# EAGLE schematic logic (EAGLE 9.6.2)
Assembly variants: basic

## Sheet 1 of 3: MCU
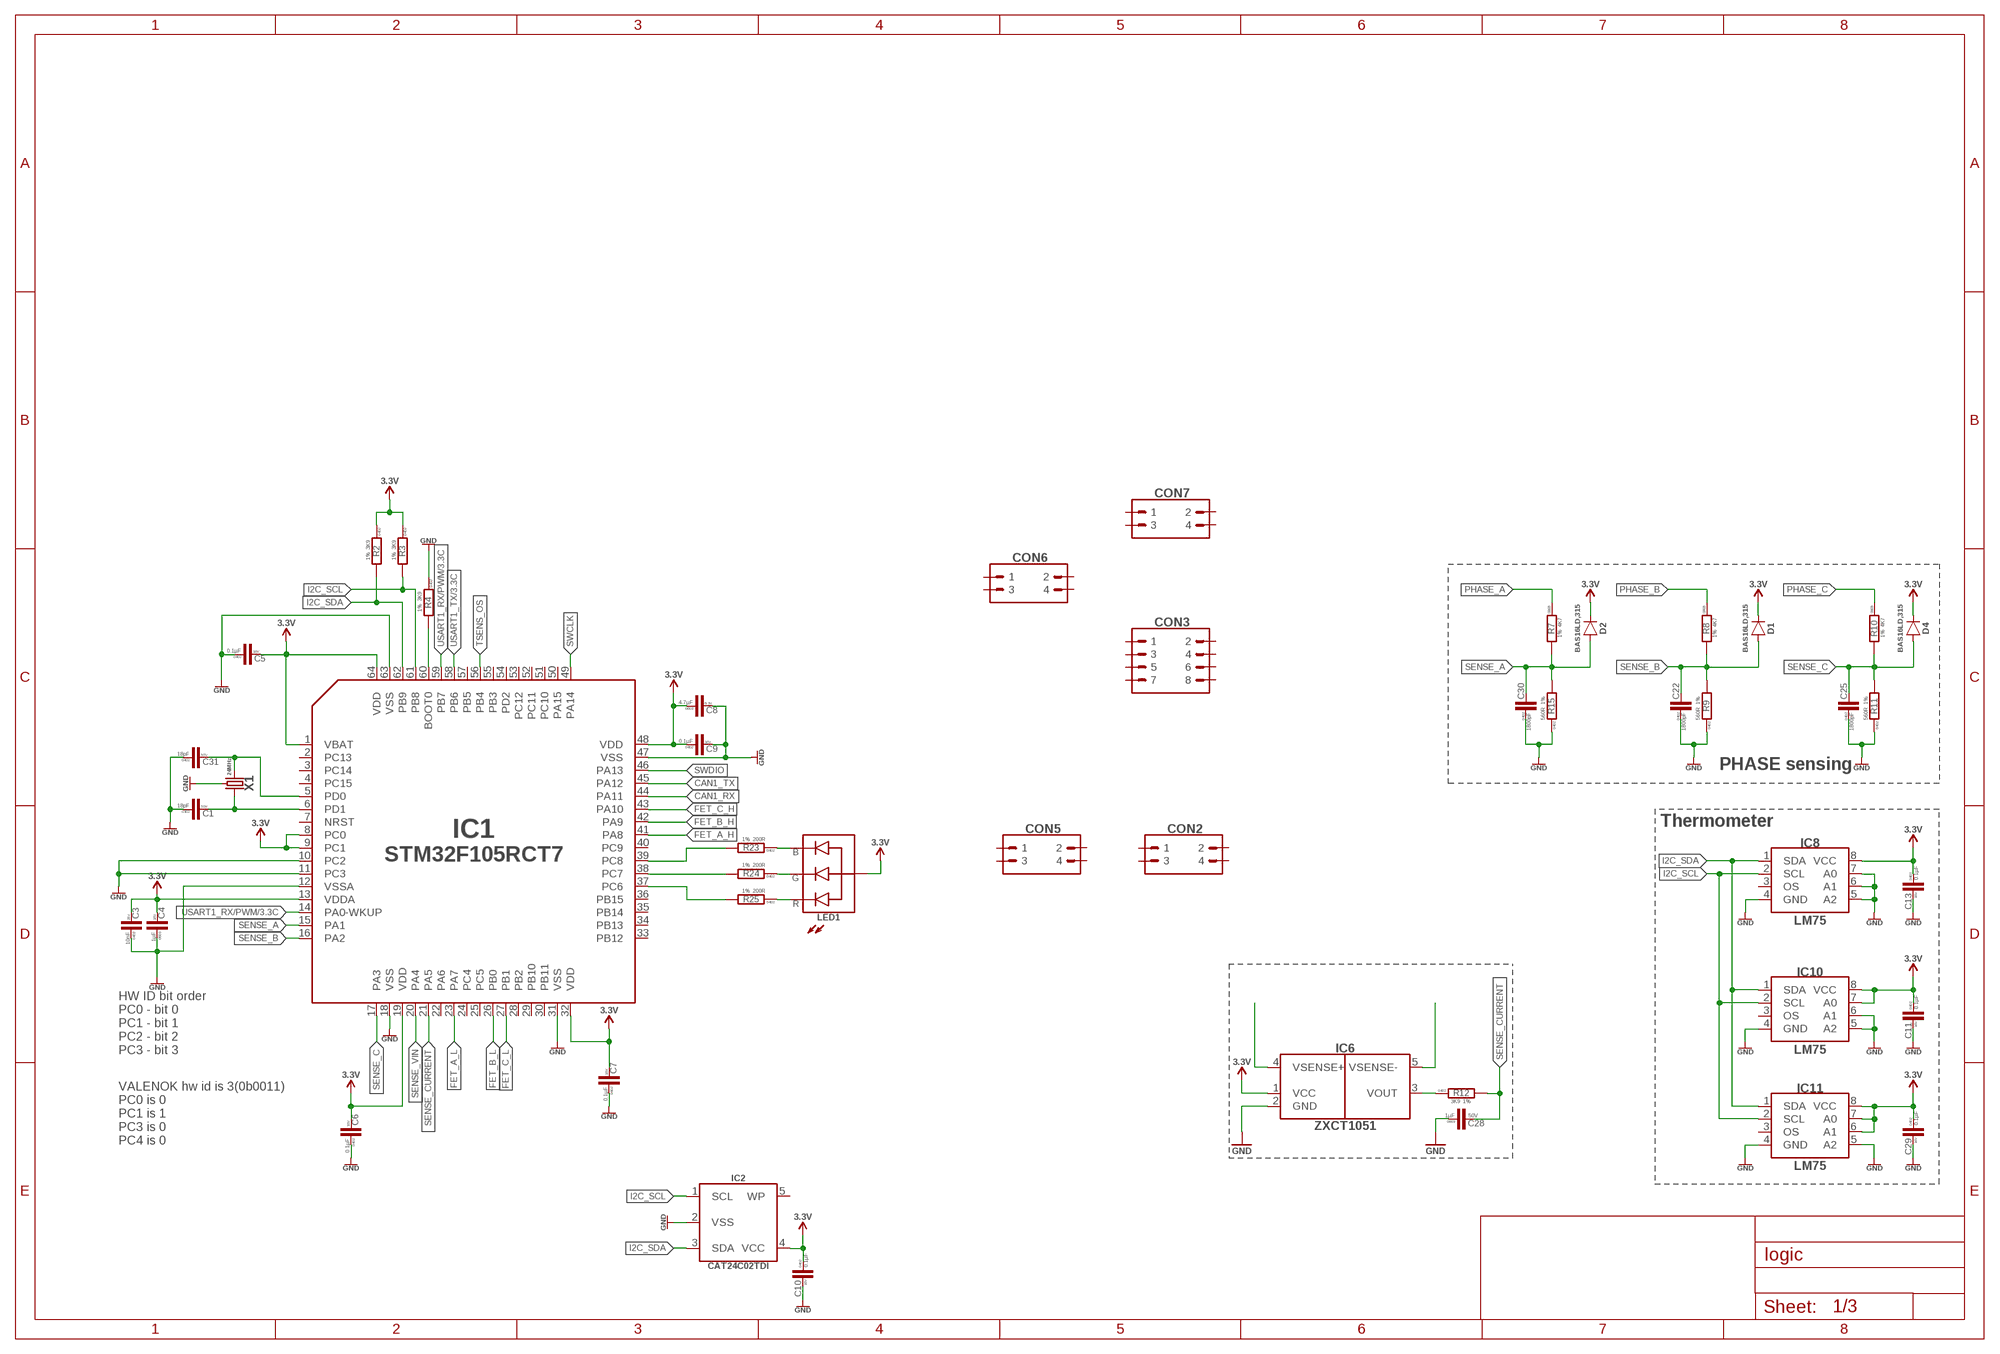
[diagram p0: schematic, sheet 1]

### Parts
C1  18pF  C-0402  [C0402]
C3  10nF  C-0402  [C0402]
C4  1µF  C-0603  [C0603]
C5  0.1µF  C-0402  [C0402]
C6  0.1µF  C-0402  [C0402]
C7  0.1µF  C-0402  [C0402]
C8  4.7µF  C-0603  [C0603]
C9  0.1µF  C-0402  [C0402]
C10  0.1µF  C-0402  [C0402]
C11  0.1µF  C-0402  [C0402]
C13  0.1µF  C-0402  [C0402]
C22  1800pF  C-0402  [C0402]
C25  1800pF  C-0402  [C0402]
C28  1µF  1µF-50V_10%_X7R-0603  [C0603]
C29  0.1µF  C-0402  [C0402]
C30  1800pF  C-0402  [C0402]
C31  18pF  C-0402  [C0402]
CON2  PINHEAD_2X02-PTH-2-MALE  [2X02-PTH-2]  (not fitted in variant basic)
CON3  PINHEAD_2X04-PLS-2  [2X04-PTH-2]
CON5  PINHEAD_2X02-PTH-2-MALE  [2X02-PTH-2]  (not fitted in variant basic)
CON6  PINHEAD_2X02-PTH-2-MALE  [2X02-PTH-2]  (not fitted in variant basic)
CON7  PINHEAD_2X02-PTH-2-MALE  [2X02-PTH-2]  (not fitted in variant basic)
D1  BAS16L  [SOD882]
D2  BAS16L  [SOD882]
D4  BAS16L  [SOD882]
IC1  STM32F105RCT6  [TQFP64]
IC2  CAT24C02  [SOT23-5L@1]
IC6  ZXCT1051  [SOT23-5L]
IC8  LM75-TSSOP8  [TSSOP8]
IC10  LM75-TSSOP8  [TSSOP8]
IC11  LM75-TSSOP8  [TSSOP8]
LED1  LTST-C19HE1WT  [0606]
R2  3K9  R-1%-0402  [R0402]
R3  3K9  R-1%-0402  [R0402]
R4  3K9  R-1%-0402  [R0402]
R7  4K7  R-1%-0805  [R0805]
R8  4K7  R-1%-0805  [R0805]
R9  560R  R-1%-0402  [R0402]
R10  4K7  R-1%-0805  [R0805]
R11  560R  R-1%-0402  [R0402]
R12  3K9  3K9-1%-0402  [R0402]
R15  560R  R-1%-0402  [R0402]
R23  200R  R-1%-0402  [R0402]
R24  200R  R-1%-0402  [R0402]
R25  200R  R-1%-0402  [R0402]
X1  24MHz  CRYSTAL-4P-24MHZ-3.2X2.5-4P  [OSCILLATOR-3.2X2.5-4P]

### Nets
BLABLA: IC6.3(VOUT) R12.1
BOOT0: IC1.60(BOOT0) R4.2
CAN1_RX: IC1.44(PA11)
CAN1_TX: IC1.45(PA12)
FET_A_H: IC1.41(PA8)
FET_A_L: IC1.23(PA7)
FET_B_H: IC1.42(PA9)
FET_B_L: IC1.26(PB0)
FET_C_H: IC1.43(PA10)
FET_C_L: IC1.27(PB1)
GND: C1.1 C3.1 C4.1 C5.1 C6.1 C7.1 C8.2 C9.2 C10.2 C11.2 C13.2 C22.1 C25.1 C28.P$1 C29.2 C30.1 C31.1 IC1.10(PC2) IC1.11(PC3) IC1.12(VSSA) IC1.18(VSS) IC1.31(VSS) IC1.47(VSS) IC1.63(VSS) IC2.2(VSS) IC6.2(GND) IC8.4(GND) IC8.5(A2) IC8.6(A1) IC8.7(A0) IC10.4(GND) IC10.5(A2) IC10.6(A1) IC11.4(GND) IC11.5(A2) R4.1 R9.1 R11.1 R15.1 X1.2(GND) X1.4(GND) ; also sheet 2,3
I2C_SCL: IC1.61(PB8) IC2.1(SCL) IC8.2(SCL) IC10.2(SCL) IC11.2(SCL) R3.2
I2C_SDA: IC1.62(PB9) IC2.3(SDA) IC8.1(SDA) IC10.1(SDA) IC11.1(SDA) R2.2
N$1: IC6.5(VSENSE-)
N$2: IC6.4(VSENSE+)
N$3: IC1.37(PC6) R25.2
N$6: LED1.B R23.1
N$7: LED1.R R25.1
N$12: IC1.38(PC7) R24.2
N$16: C31.2 IC1.5(PD0) X1.3
N$18: IC1.39(PC8) R23.2
N$21: C1.2 IC1.6(PD1) X1.1
N$26: LED1.G R24.1
PHASE_A: R7.1
PHASE_B: R8.1
PHASE_C: R10.1
SENSE_A: C30.2 D2.A IC1.15(PA1) R7.2 R15.2
SENSE_B: C22.2 D1.A IC1.16(PA2) R8.2 R9.2
SENSE_C: C25.2 D4.A IC1.17(PA3) R10.2 R11.2
SENSE_CURRENT: C28.P$2 IC1.21(PA5) R12.2
SENSE_VIN: IC1.20(PA4)
SWCLK: IC1.49(PA14)
SWDIO: IC1.46(PA13)
TSENS_OS: IC1.56(PB4)
USART1_RX/PWM: IC1.14(PA0-WKUP) IC1.59(PB7) ; also sheet 3
USART1_TX: IC1.58(PB6) ; also sheet 3
VDD_3V3: C3.2 C4.2 C5.2 C6.2 C7.2 C8.1 C9.1 C10.1 C11.1 C13.1 C29.1 D1.C D2.C D4.C IC1.1(VBAT) IC1.8(PC0) IC1.9(PC1) IC1.13(VDDA) IC1.19(VDD) IC1.32(VDD) IC1.48(VDD) IC1.64(VDD) IC2.4(VCC) IC6.1(VCC) IC8.8(VCC) IC10.7(A0) IC10.8(VCC) IC11.6(A1) IC11.7(A0) IC11.8(VCC) LED1.+(A) R2.1 R3.1 ; supply symbol labelled 3.3V ; also sheet 2,3
Unconnected: CON2.1 CON2.2 CON2.3 CON2.4 CON3.1 CON3.2 CON3.3 CON3.4 CON3.5 CON3.6 CON3.7 CON3.8 CON5.1 CON5.2 CON5.3 CON5.4 CON6.1 CON6.2 CON6.3 CON6.4 CON7.1 CON7.2 CON7.3 CON7.4 IC1.2(PC13) IC1.3(PC14) IC1.4(PC15) IC1.7(NRST) IC1.22(PA6) IC1.24(PC4) IC1.25(PC5) IC1.28(PB2) IC1.29(PB10) IC1.30(PB11) IC1.33(PB12) IC1.34(PB13) IC1.35(PB14) IC1.36(PB15) IC1.40(PC9) IC1.50(PA15) IC1.51(PC10) IC1.52(PC11) IC1.53(PC12) IC1.54(PD2) IC1.55(PB3) IC1.57(PB5) IC2.5(WP) IC8.3(OS) IC10.3(OS) IC11.3(OS)

### Notes on the sheet
- PHASE sensing
- Thermometer
- HW ID bit order
  PC0 - bit 0
  PC1 - bit 1
  PC2 - bit 2
  PC3 - bit 3
- VALENOK hw id is 3(0b0011)
  PC0 is 0
  PC1 is 1
  PC3 is 0
  PC4 is 0

## Sheet 2 of 3: Power
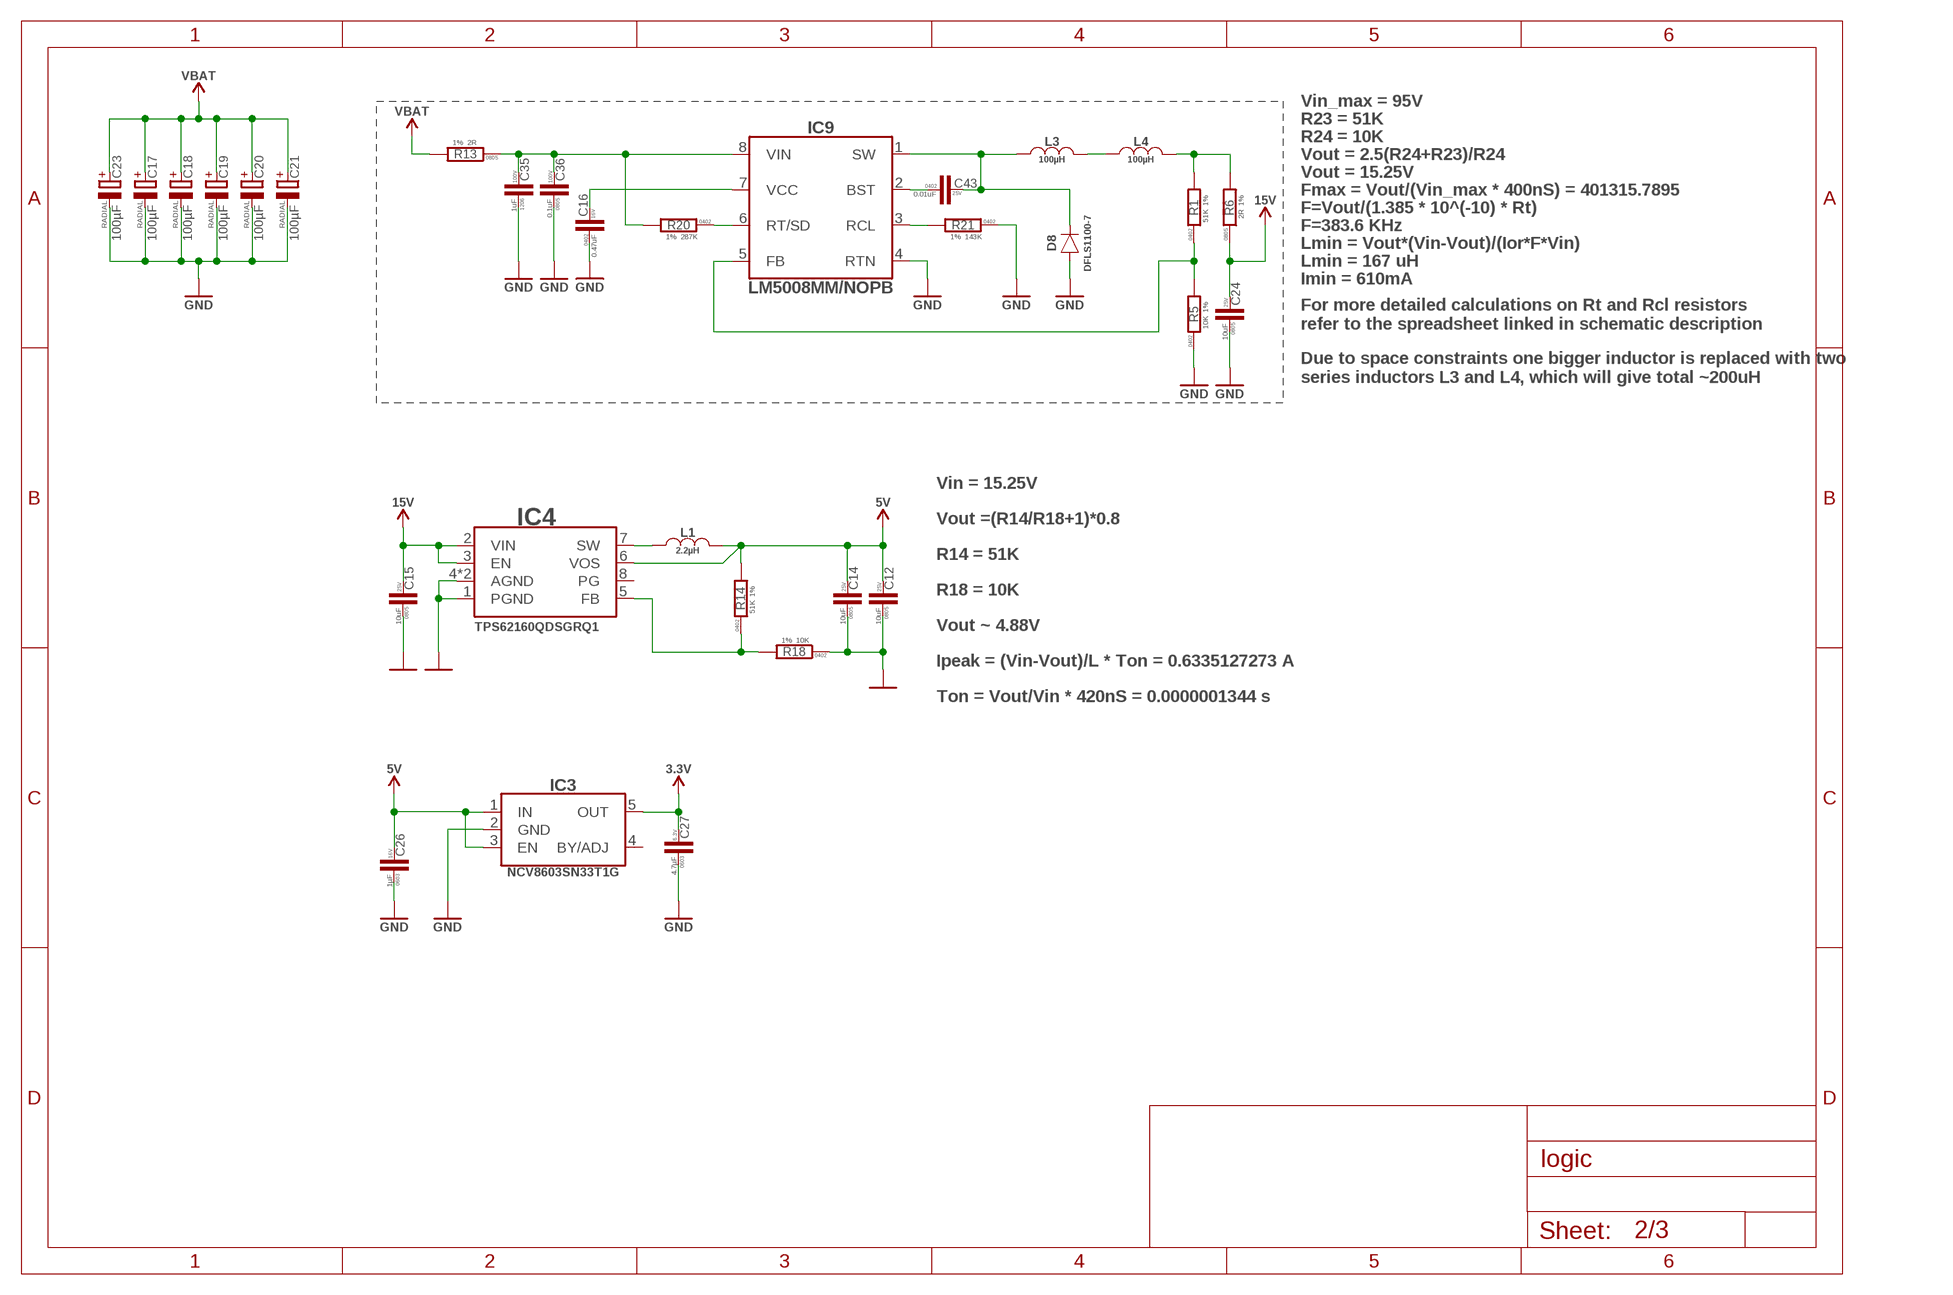
[diagram p1: schematic, sheet 2]

### Parts
C12  10uF  C-0805  [C0805]
C14  10uF  C-0805  [C0805]
C15  10uF  C-0805  [C0805]
C16  0.47uF  C-0402  [C0402]
C17  100µF  CPOL-RADIAL_SIDE-12.5-22  [RADIAL_SIDE_12.5X22]
C18  100µF  CPOL-RADIAL_SIDE-12.5-22  [RADIAL_SIDE_12.5X22]
C19  100µF  CPOL-RADIAL_SIDE-12.5-22  [RADIAL_SIDE_12.5X22]
C20  100µF  CPOL-RADIAL_SIDE-12.5-22  [RADIAL_SIDE_12.5X22]
C21  100µF  CPOL-RADIAL_SIDE-12.5-22  [RADIAL_SIDE_12.5X22]
C23  100µF  CPOL-RADIAL_SIDE-12.5-22  [RADIAL_SIDE_12.5X22]
C24  10uF  C-0805  [C0805]
C26  1µF  C-0603  [C0603]
C27  4.7µF  C-0603  [C0603]
C35  1uF  C-1206  [C1206]
C36  0.1uF  C-0805  [C0805]
C43  0.01uF  C-0402  [C0402]
D8  DFLS1100  [POWERDI-123]
IC3  NCV8603SN33  [SOT23-5]
IC4  TPS62160QDSGRQ1  [WFDFN-8]
IC9  LM5008-MSOP8  [MSOP8]
L1  2.2µH  2.2µH-NRS3015  [NR3015]
L3  100µH  100µH-LQS-6028  [LQS-6028]
L4  100µH  100µH-LQS-6028  [LQS-6028]
R1  51K  R-1%-0402  [R0402]
R5  10K  R-1%-0402  [R0402]
R6  2R  R-1%-0805  [R0805]
R13  2R  R-1%-0805  [R0805]
R14  51K  R-1%-0402  [R0402]
R18  10K  R-1%-0402  [R0402]
R20  287K  R-1%-0402  [R0402]
R21  143K  R-1%-0402  [R0402]

### Nets
GND: C12.1 C14.1 C15.1 C16.1 C17.- C18.- C19.- C20.- C21.- C23.- C24.1 C26.1 C27.1 C35.P$1 C36.1 D8.A IC3.2(GND) IC4.1(PGND) IC4.4(AGND) IC4.EP(AGND) IC9.4(RTN) R5.1 R18.1 R21.1 ; also sheet 1,3
N$4: IC4.7(SW) L1.1
N$5: C16.2 IC9.7(VCC)
N$8: IC9.6(RT/SD) R20.1
N$9: IC4.5(FB) R14.1 R18.2
N$10: C35.P$2 C36.2 IC9.8(VIN) R13.1 R20.2
N$11: C43.1 IC9.2(BST)
N$13: IC9.3(RCL) R21.2
N$14: C43.2 D8.C IC9.1(SW) L3.P$1
N$15: L4.P$2 R1.2 R6.2
N$17: L3.P$2 L4.P$1
N$50: IC9.5(FB) R1.1 R5.2
VBAT: C17.+ C18.+ C19.+ C20.+ C21.+ C23.+ R13.2
VDD_3V3: C27.2 IC3.5(OUT) ; supply symbol labelled 3.3V ; also sheet 1,3
VDD_5V: C12.2 C14.2 C26.2 IC3.1(IN) IC3.3(EN) IC4.6(VOS) L1.2 R14.2 ; supply symbol labelled 5V
VDD_15V: C15.2 C24.2 IC4.2(VIN) IC4.3(EN) R6.1 ; supply symbol labelled 15V
Unconnected: IC3.4(BY/ADJ) IC4.8(PG)

### Notes on the sheet
- Vin_max = 95V
- R23 = 51K
- R24 = 10K
- Vout = 2.5(R24+R23)/R24
- Vout = 15.25V
- Fmax = Vout/(Vin_max * 400nS) = 401315.7895
- F=Vout/(1.385 * 10^(-10) * Rt)
- F=383.6 KHz
- Lmin = Vout*(Vin-Vout)/(Ior*F*Vin)
- Lmin = 167 uH
- Imin = 610mA
- For more detailed calculations on Rt and Rcl resistors
  refer to the spreadsheet linked in schematic description
- Due to space constraints one bigger inductor is replaced with two
  series inductors L3 and L4, which will give total ~200uH
- Vin = 15.25V
- Vout =(R14/R18+1)*0.8
- R14 = 51K
- R18 = 10K
- Vout ~ 4.88V
- Ipeak = (Vin-Vout)/L * Ton = 0.6335127273 A
- Ton = Vout/Vin * 420nS = 0.0000001344 s

## Sheet 3 of 3: Interfaces
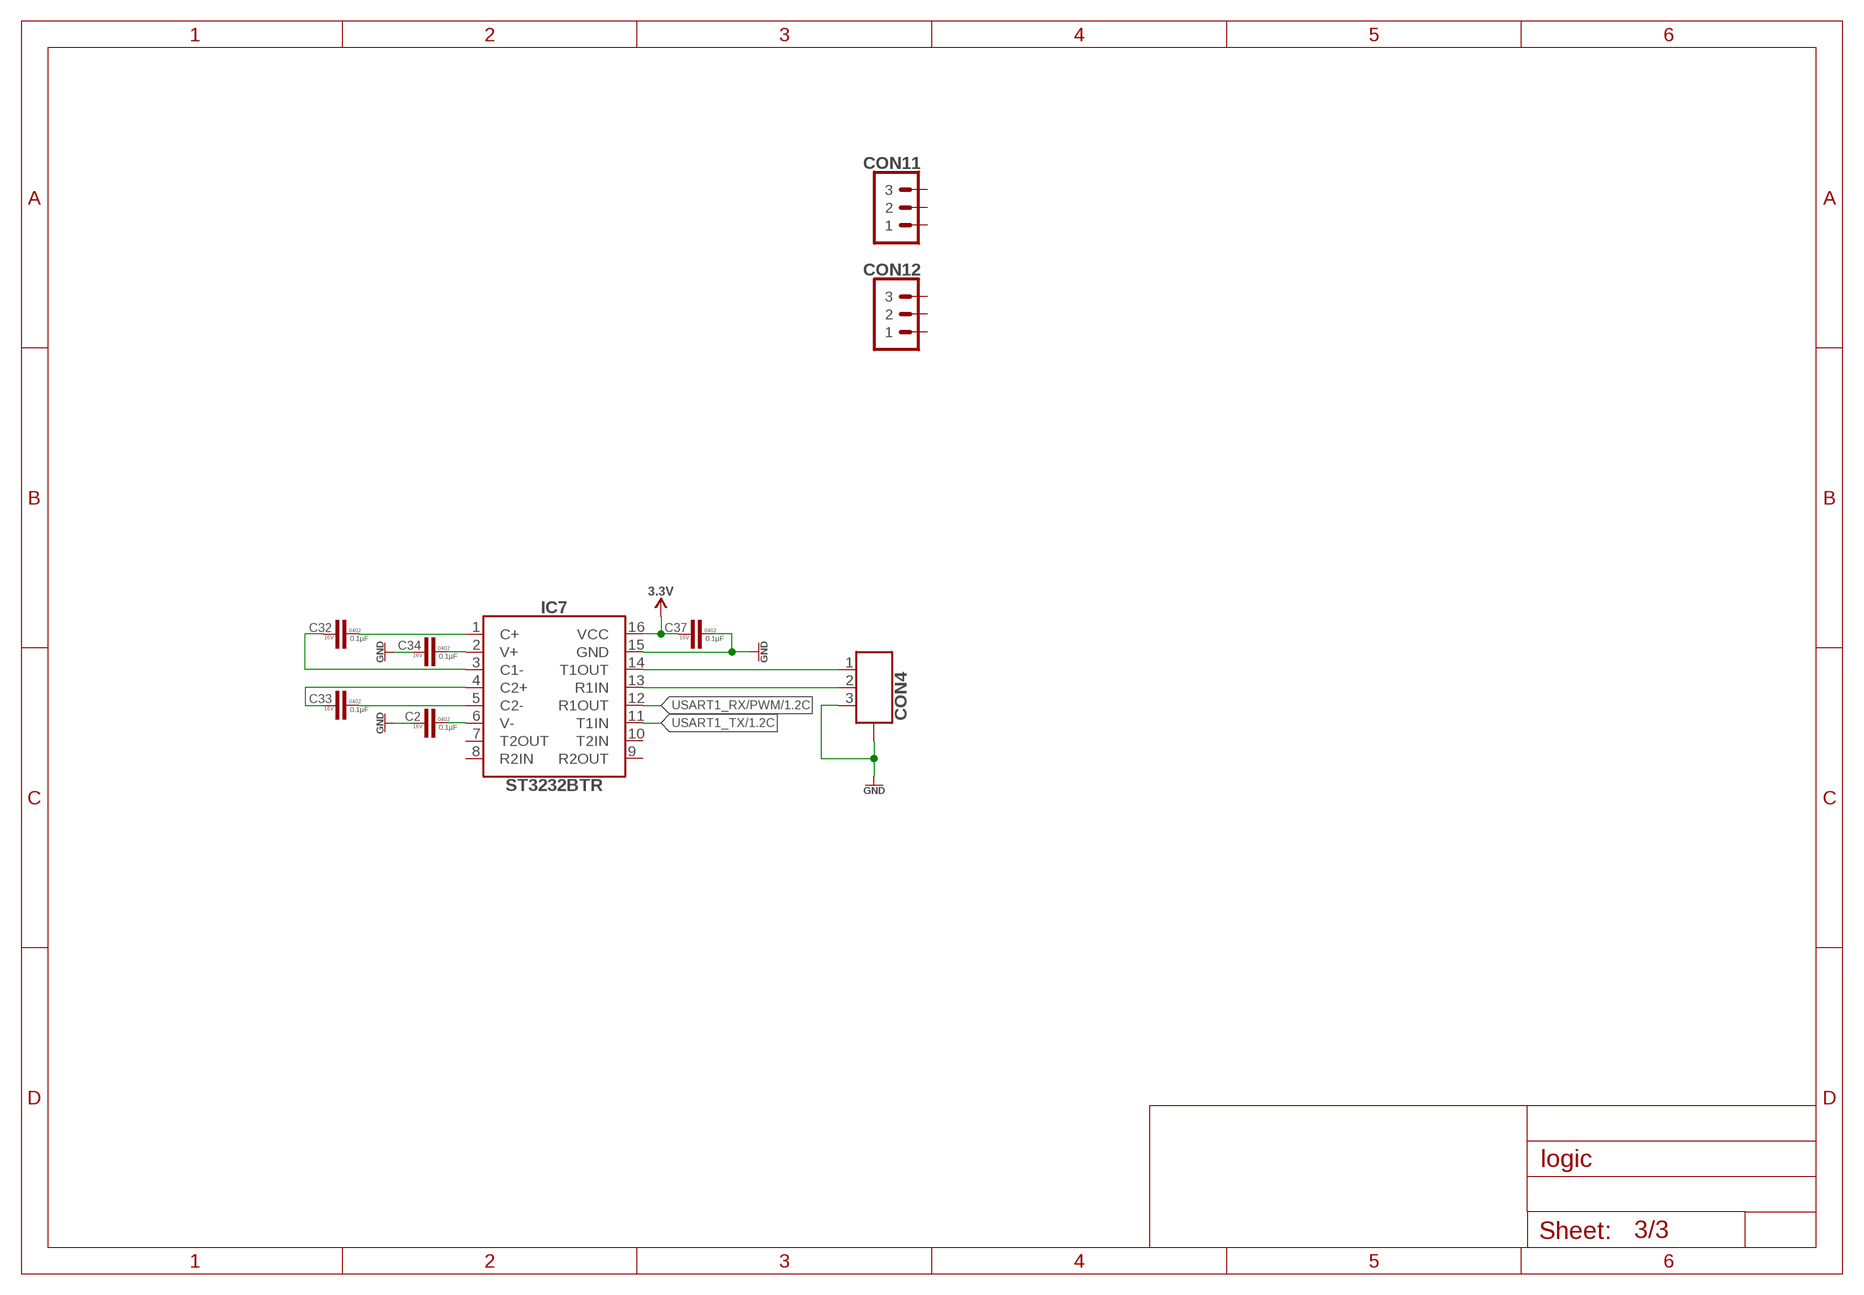
[diagram p2: schematic, sheet 3]

### Parts
C2  0.1µF  C-0402  [C0402]
C32  0.1µF  C-0402  [C0402]
C33  0.1µF  C-0402  [C0402]
C34  0.1µF  C-0402  [C0402]
C37  0.1µF  C-0402  [C0402]
CON4  CON-3P-TABS  [JST_GH-3P-RA]
CON11  PINHEAD_1X03-2  [1X03-PTH-2]
CON12  PINHEAD_1X03-2  [1X03-PTH-2]
IC7  ST3232  [TSSOP16]

### Nets
GND: C2.2 C34.2 C37.1 CON4.3 CON4.M$0(GND) CON4.M$1(GND) IC7.15(GND) ; also sheet 1,2
N$19: C32.1 IC7.1(C+)
N$20: C32.2 IC7.3(C1-)
N$22: C33.1 IC7.5(C2-)
N$24: C33.2 IC7.4(C2+)
N$27: C2.1 IC7.6(V-)
N$28: C34.1 IC7.2(V+)
N$29: CON4.2 IC7.13(R1IN)
N$30: CON4.1 IC7.14(T1OUT)
USART1_RX/PWM: IC7.12(R1OUT) ; also sheet 1
USART1_TX: IC7.11(T1IN) ; also sheet 1
VDD_3V3: C37.2 IC7.16(VCC) ; supply symbol labelled 3.3V ; also sheet 1,2
Unconnected: CON11.1 CON11.2 CON11.3 CON12.1 CON12.2 CON12.3 IC7.7(T2OUT) IC7.8(R2IN) IC7.9(R2OUT) IC7.10(T2IN)

## Library data of the parts
C1 C31 = rc:C; AEC-Q: ---; DIGIKEY#: 399-8828-1-ND; MANF: Kemet; MANF#: CBR04C180F5GAC; OPERATING_TEMP: -55°C ~ 125°C; PACKAGE: 0402; VOLTAGE: 50V
C2 C5-C7 C9-C11 C13 C29 C32-C34 C37 = rc:C; AEC-Q: ---; DIGIKEY#: 490-3261-1-ND; MANF: Murata Electronics; MANF#: GRM155R71C104KA88D; OPERATING_TEMP: -55°C ~ 125°C; PACKAGE: 0402; VOLTAGE: 16V
C3 = rc:C; AEC-Q: ---; DIGIKEY#: 490-6043-1-ND; MANF: Murata Electronics; MANF#: GCM155R71E103KA37D; OPERATING_TEMP: -55°C ~ 125°C; PACKAGE: 0402; VOLTAGE: 25V
C4 C26 = rc:C; AEC-Q: AEC-Q200; DIGIKEY#: 445-12539-1-ND; MANF: TDK Corporation; MANF#: CGA3E1X7R1C105K080AC; OPERATING_TEMP: -55°C ~ 125°C; PACKAGE: 0603; VOLTAGE: 16V
C8 C27 = rc:C; AEC-Q: ---; DIGIKEY#: 1276-2087-1-ND; MANF: Samsung Electro-Mechanics; MANF#: CL10B475KQ8NQNC; OPERATING_TEMP: -55°C ~ 125°C; PACKAGE: 0603; VOLTAGE: 6.3V
C12 C14 C15 C24 = rc:C; AEC-Q: AEC-Q200; DIGIKEY#: 445-181411-1-ND; MANF: TDK Corporation; MANF#: CGA4J1X7S1E106K125AE; PACKAGE: 0805; VOLTAGE: 25V
C16 = rc:C; AEC-Q: AEC-Q200; DIGIKEY#: 490-12244-1-ND; MANF: Murata Electronics; MANF#: GRT155C81C474ME01D; PACKAGE: 0402; TC: X7R; VOLTAGE: 16V
C17-C21 C23 = rc:CPOL: Polar tantalum capacitor; DIGIKEY#: 493-4784-3-ND; MANF: Nichicon; MANF#: UCY2C101MHD1TO; PACKAGE: RADIAL; VALUE: 330µF; VOLTAGE: 160V
C22 C25 C30 = rc:C; PACKAGE: 0402
C28 = C_digikey:1µF; DIGIKEY#: 587-3247-1-ND; MANF: Taiyo Yuden; MANF#: UMK107AB7105KA-T; OPERATING_TEMP: -55°C ~ 125°C; PACKAGE: 0603; TC: X7R; TOLERANCE: +-10%; VOLTAGE: 50V
C35 = rc:C; AEC-Q: AEC-Q200; DIGIKEY#: 490-16468-1-ND; MANF: Murata Electronics; MANF#: GCJ31CR72A105KA01L; PACKAGE: 1206; VOLTAGE: 100V
C36 = rc:C; AEC-Q: AEC-Q200; DIGIKEY#: 445-5827-1-ND; MANF: TDK Corporation; MANF#: CGA4J2X7R2A104K125AA; PACKAGE: 0805; VOLTAGE: 100V
C43 = rc:C; AEC-Q: AEC-Q200; DIGIKEY#: 490-6043-1-ND; MANF: Murata Electronics; MANF#: GCM155R71E103KA37D; PACKAGE: 0402; VOLTAGE: 25V
CON2 CON5-CON7 = pinhead:PINHEAD_2X02
CON3 = pinhead:PINHEAD_2X04
CON4 = Connectors:CON-3P-TABS
CON11 CON12 = pinhead:PINHEAD_1X03: pinheader 3P
D1 D2 D4 = Diodes:BAS16L: Diode Standard 100V 215mA (DC) Surface Mount 2-DFN1006D (0.6x1.0); AEC-Q: AEC-Q101; DIGIKEY#: 1727-4421-2-ND; MANF: Nexperia USA Inc; MANF#: BAS16LD,315
D8 = Diodes:DFLS1100: Diode Schottky 100V 1A Surface Mount PowerDI™ 123; AEC-Q: AEC-Q101; DIGIKEY#: DFLS1100DITR-ND; MANF: Diodes Incorporated; MANF#: DFLS1100-7
IC1 = stm32:STM32F105RCT6: ARM® Cortex®-M3 STM32F1 Microcontroller IC 32-Bit 72MHz 256KB (256K x 8) FLASH; DIGIKEY#: 497-11547-ND; MANF: STMicroelectronics; MANF#: STM32F105RCT7; OPERATING_TEMP: -40°C ~ 105°C (TA)
IC2 = misc:CAT24C02: IC EEPROM 2KBIT 400KHZ TSOT23-5; DIGIKEY#: CAT24C02TDI-GT3AOSCT-ND; MANF: ON Semiconductor; MANF#: CAT24C02TDI-GT3A
IC3 = linear regulators:NCV8603SN: Linear Voltage Regulator IC Positive; AEC-Q: AEC-Q100; DIGIKEY#: NCV8603SN33T1GOSCT-ND; MANF: ON Semiconductor; MANF#: NCV8603SN33T1G
IC4 = dc-dc:TPS62160QDSGRQ1: Buck Switching Regulator IC Positive Adjustable 0.9V 1 Output 1A 8-WFDFN Exposed Pad; AEC-Q: AEC-Q100; DIGIKEY#: 296-40840-1-ND; MANF: Texas Instruments; MANF#: TPS62160QDSGRQ1
IC6 = misc:ZXCT1051: IC CURRENT MONITOR 1% SOT23-5; DIGIKEY#: ZXCT1051E5CT-ND; MANF: Diodes Incorporated; MANF#: ZXCT1051E5TA
IC7 = serial_interfaces:ST3232: 2/2 Transceiver Full RS232 16-TSSOP; DIGIKEY#: 497-6534-1-ND; MANF: STMicroelectronics; MANF#: ST3232BTR
IC8 IC10 IC11 = misc:LM75: SENSOR TEMPERATURE I2C 8TSSOP; DIGIKEY#: 568-4768-1-ND; MANF: NXP Semiconductors; MANF#: LM75BDP,118
IC9 = dc-dc:LM5008: Buck Switching Regulator IC Positive Adjustable 2.5V 1 Output 350mA 8-TSSOP, 8-MSOP (0.118", 3.00mm Width); DIGIKEY#: 296-LM5008MM/NOPBCT-ND; MANF: Texas Instruments; MANF#: LM5008MM/NOPB
L1 = power_inductors:2.2µH; AEC-Q: AEC-Q200; CURRENT: 1.5A; DIGIKEY#: 587-3561-1-ND; HEIGHT: 1.5mm; MANF: Taiyo Yuden; MANF#: NRS3015T2R2MNGHV
L3 L4 = power_inductors:100µH; DIGIKEY#: 732-5534-6-ND; MANF: Wurth Electronics Inc; MANF#: 74404063101
LED1 = misc:LTST-C19HE1WT: LED RGB DIFFUSED CHIP SMD; DIGIKEY#: 160-2162-1-ND; MANF: Lite-On Inc; MANF#: LTST-C19HE1WT
R1 R14 = rc:R; AEC-Q: AEC-Q200; DIGIKEY#: P51.0KLCT-ND; MANF: Panasonic Electronic Components; MANF#: ERJ-2RKF5102X; PACKAGE: 0402; TOLERANCE: 1%
R2-R4 = rc:R; AEC-Q: ---; DIGIKEY#: 311-3.90KLRCT-ND; MANF: Yageo; MANF#: RC0402FR-073K9L; OPERATING_TEMP: -55°C ~ 155°C; PACKAGE: 0402; TOLERANCE: 1%
R5 R18 = rc:R; AEC-Q: AEC-Q200; DIGIKEY#: P10.0KLCT-ND; MANF: Panasonic Electronic Components; MANF#: ERJ-2RKF1002X; PACKAGE: 0402; TOLERANCE: 1%
R6 R13 = rc:R; AEC-Q: AEC-Q200; DIGIKEY#: RMCF0805FT2R00CT-ND; MANF: Stackpole Electronics Inc; MANF#: RMCF0805FT2R00; PACKAGE: 0805; TOLERANCE: 1%
R7 R8 R10 = rc:R; PACKAGE: 0805; TOLERANCE: 1%
R9 R11 R15 = rc:R; PACKAGE: 0402; TOLERANCE: 1%
R12 = R_digikey:3K9; DIGIKEY#: 311-3.90KLRCT-ND; MANF: Yageo; MANF#: RC0402FR-073K9L; PACKAGE: 0402; TOLERANCE: 1%
R20 = rc:R; AEC-Q: AEC-Q200; DIGIKEY#: P287KLCT-ND; MANF: Panasonic Electronic Components; MANF#: ERJ-2RKF2873X; PACKAGE: 0402; TOLERANCE: 1%
R21 = rc:R; AEC-Q: AEC-Q200; DIGIKEY#: P122734CT-ND; MANF: Panasonic Electronic Components; MANF#: ERJ-1GNF1433C; PACKAGE: 0402; TOLERANCE: 1%
R23-R25 = rc:R; AEC-Q: ---; DIGIKEY#: 311-200JRCT-ND; MANF: Yageo; MANF#: RC0402JR-07200RL; OPERATING_TEMP: -55°C ~ 155°C; PACKAGE: 0402; TOLERANCE: 1%
X1 = crystal:CRYSTAL-4P: Smd Crystal 18pF; DIGIKEY#: 1253-1198-1-ND; MANF: Kyocera International Inc. Electronic Components; MANF#: CX3225GB24000P0HPQCC